# EAGLE design CaravanPi_V2 (EAGLE 9.6.2)
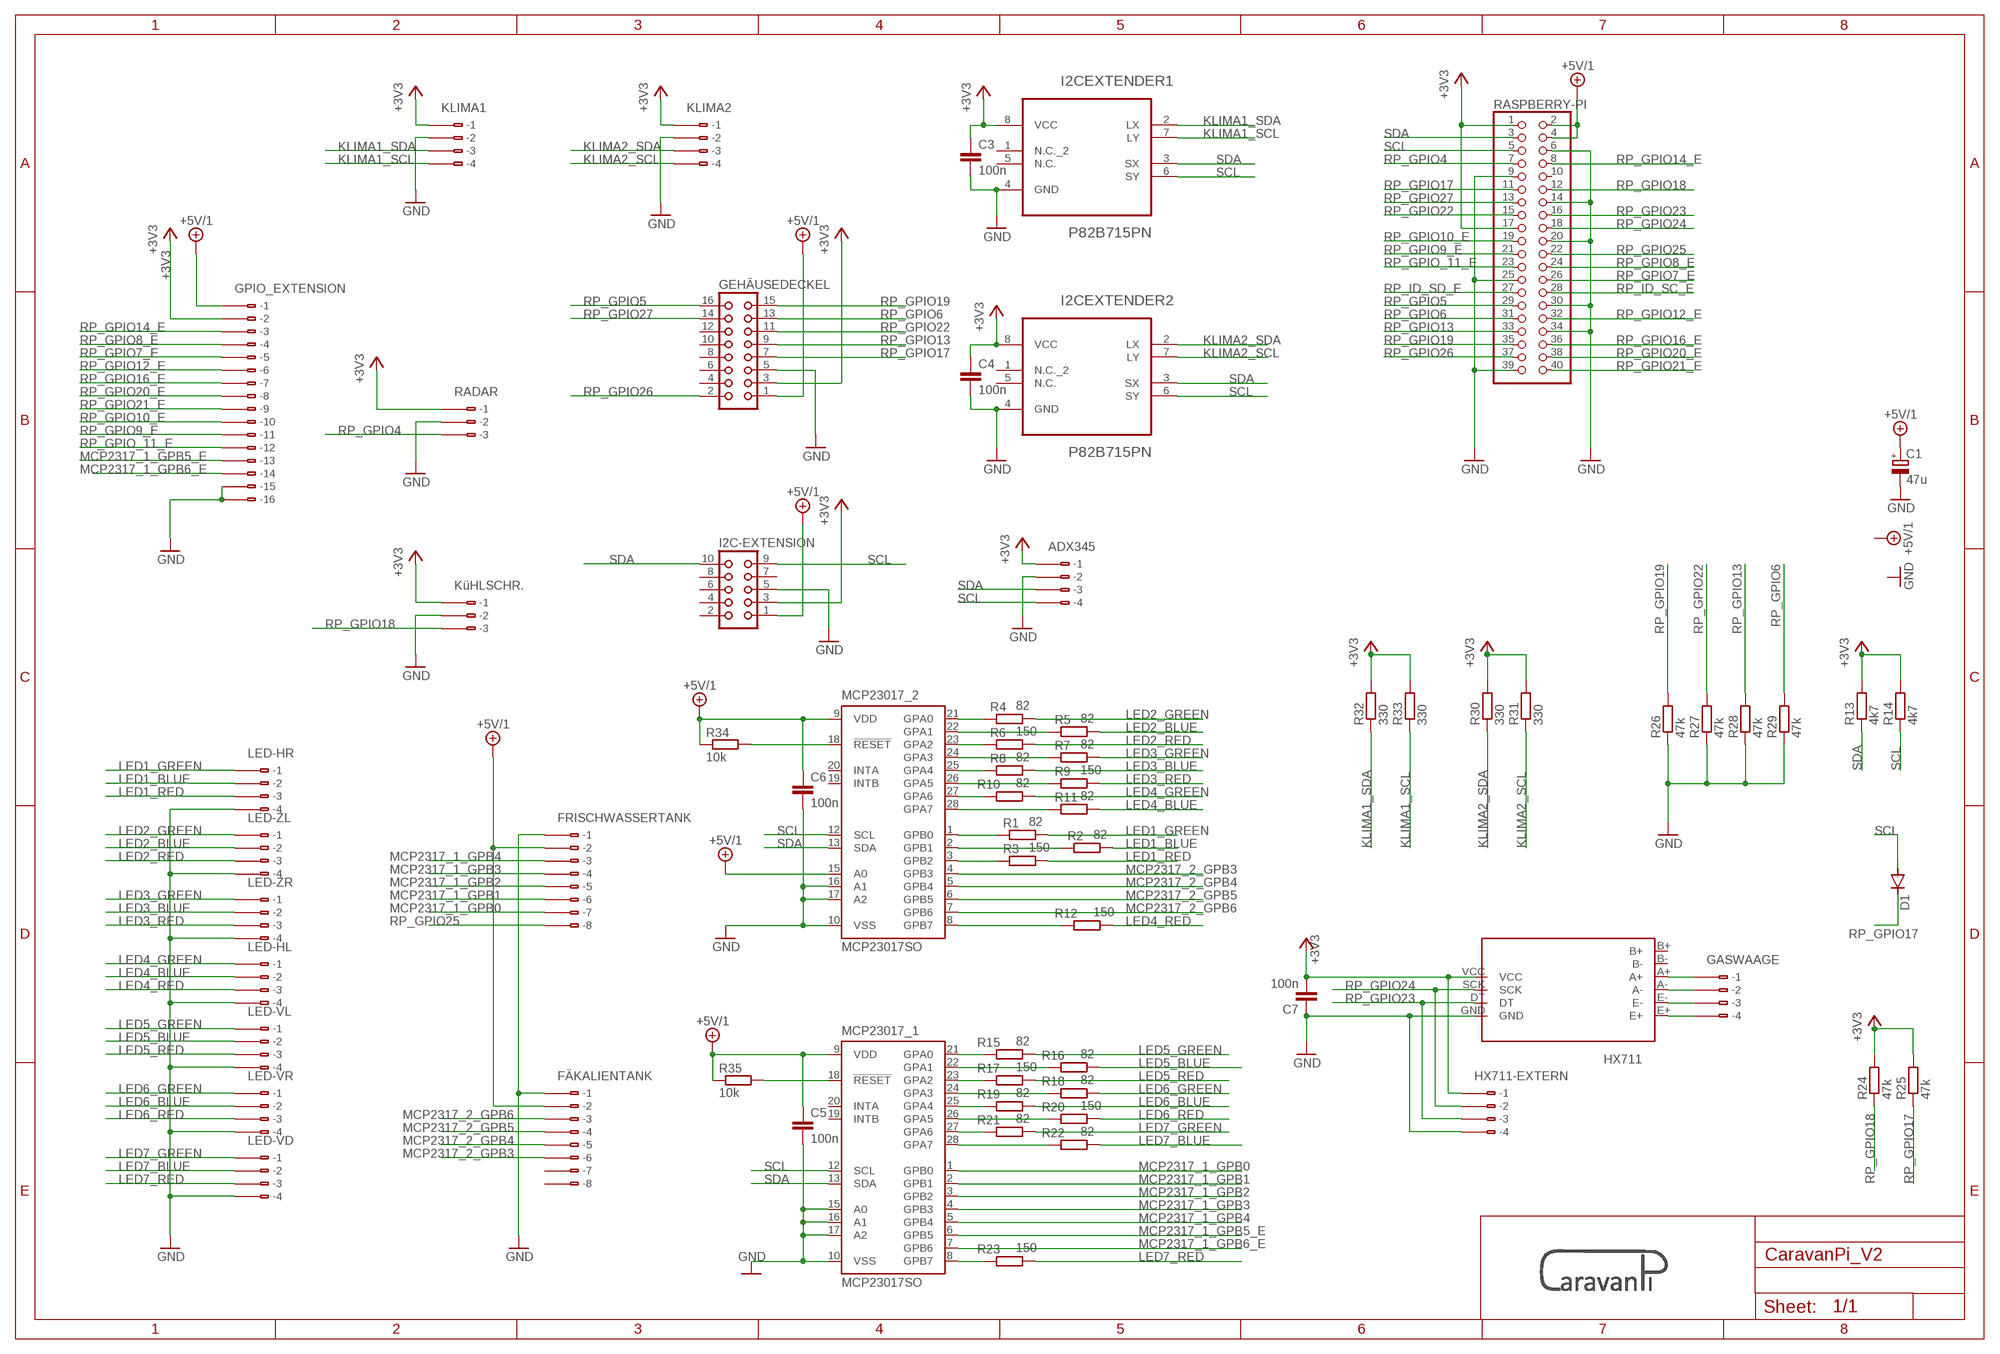
[diagram p0: schematic, sheet 1]

## Parts
ADX345  233-404  [233-404]
C1  47u  CPOL-EUSMCC  [SMC_C]
C3  100n  C-EUC1206  [C1206]
C4  100n  C-EUC1206  [C1206]
C5  100n  C-EUC1206  [C1206]
C6  100n  C-EUC1206  [C1206]
C7  100n  C-EUC1206  [C1206]
D1  DIODE-DO214AC  [DO214AC]
FRISCHWASSERTANK  233-408  [233-408]
FÄKALIENTANK  233-408  [233-408]
GASWAAGE  233-404  [233-404]
GEHÄUSEDECKEL  CON16  [CON16]
GPIO_EXTENSION  233-516  [233-516]
HX711  HX711A  [HX711]
HX711-EXTERN  233-404  [233-404]
I2C-EXTENSION  CON10  [CON10]
I2CEXTENDER1  P82B715PN  [DIP254P762X420-8]
I2CEXTENDER2  P82B715PN  [DIP254P762X420-8]
KLIMA1  233-404  [233-404]
KLIMA2  233-404  [233-404]
KüHLSCHR.  233-403  [233-403]
LED-HL  233-504  [233-504]
LED-HR  233-504  [233-504]
LED-VD  233-504  [233-504]
LED-VL  233-504  [233-504]
LED-VR  233-504  [233-504]
LED-ZL  233-504  [233-504]
LED-ZR  233-504  [233-504]
MCP23017_1  MCP23017SO  [SO28W]
MCP23017_2  MCP23017SO  [SO28W]
R1  82  R-EU_M1206  [M1206]
R2  82  R-EU_M1206  [M1206]
R3  150  R-EU_M1206  [M1206]
R4  82  R-EU_M1206  [M1206]
R5  82  R-EU_M1206  [M1206]
R6  150  R-EU_M1206  [M1206]
R7  82  R-EU_M1206  [M1206]
R8  82  R-EU_M1206  [M1206]
R9  150  R-EU_M1206  [M1206]
R10  82  R-EU_M1206  [M1206]
R11  82  R-EU_M1206  [M1206]
R12  150  R-EU_M1206  [M1206]
R13  4k7  R-EU_M1206  [M1206]
R14  4k7  R-EU_M1206  [M1206]
R15  82  R-EU_M1206  [M1206]
R16  82  R-EU_M1206  [M1206]
R17  150  R-EU_M1206  [M1206]
R18  82  R-EU_M1206  [M1206]
R19  82  R-EU_M1206  [M1206]
R20  150  R-EU_M1206  [M1206]
R21  82  R-EU_M1206  [M1206]
R22  82  R-EU_M1206  [M1206]
R23  150  R-EU_M1206  [M1206]
R24  47k  R-EU_M1206  [M1206]
R25  47k  R-EU_M1206  [M1206]
R26  47k  R-EU_M1206  [M1206]
R27  47k  R-EU_M1206  [M1206]
R28  47k  R-EU_M1206  [M1206]
R29  47k  R-EU_M1206  [M1206]
R30  330  R-EU_M1206  [M1206]
R31  330  R-EU_M1206  [M1206]
R32  330  R-EU_M1206  [M1206]
R33  330  R-EU_M1206  [M1206]
R34  10k  R-EU_M1206  [M1206]
R35  10k  R-EU_M1206  [M1206]
RADAR  233-403  [233-403]
RASPBERRY-PI  PINHD-2X20  [2X20]
U$1  CARAVAN_PI_LOGO  [CARAVAN_PI_LOGO]

## Nets
+3V3 [Power]: ADX345.B1(B-1) C3.1 C4.1 C7.2 GEHÄUSEDECKEL.3 GPIO_EXTENSION.B2(B-2) HX711-EXTERN.B1(B-1) HX711.VCC I2C-EXTENSION.3 I2CEXTENDER1.8(VCC) I2CEXTENDER2.8(VCC) KLIMA1.B1(B-1) KLIMA2.B1(B-1) KüHLSCHR..B1(B-1) R13.2 R14.2 R24.2 R25.2 R30.2 R31.2 R32.2 R33.2 RADAR.B1(B-1) RASPBERRY-PI.1 RASPBERRY-PI.17
+5V/1 [Power]: C1.+ C5.1 C6.1 FRISCHWASSERTANK.B2(B-2) FÄKALIENTANK.B2(B-2) GEHÄUSEDECKEL.1 GPIO_EXTENSION.B1(B-1) I2C-EXTENSION.1 MCP23017_1.9(VDD) MCP23017_2.9(VDD) MCP23017_2.15(A0) R34.1 R35.1 RASPBERRY-PI.2 RASPBERRY-PI.4
GND [Power]: ADX345.B2(B-2) C1.- C3.2 C4.2 C5.2 C6.2 C7.1 FRISCHWASSERTANK.B1(B-1) FÄKALIENTANK.B1(B-1) GEHÄUSEDECKEL.5 GPIO_EXTENSION.B15(B-15) GPIO_EXTENSION.B16(B-16) HX711-EXTERN.B4(B-4) HX711.GND I2C-EXTENSION.5 I2CEXTENDER1.4(GND) I2CEXTENDER2.4(GND) KLIMA1.B2(B-2) KLIMA2.B2(B-2) KüHLSCHR..B2(B-2) LED-HL.B4(B-4) LED-HR.B4(B-4) LED-VD.B4(B-4) LED-VL.B4(B-4) LED-VR.B4(B-4) LED-ZL.B4(B-4) LED-ZR.B4(B-4) MCP23017_1.10(VSS) MCP23017_1.15(A0) MCP23017_1.16(A1) MCP23017_1.17(A2) MCP23017_2.10(VSS) MCP23017_2.16(A1) MCP23017_2.17(A2) R26.1 R27.1 R28.1 R29.1 RADAR.B2(B-2) RASPBERRY-PI.6 RASPBERRY-PI.9 RASPBERRY-PI.14 RASPBERRY-PI.20 RASPBERRY-PI.25 RASPBERRY-PI.30 RASPBERRY-PI.34 RASPBERRY-PI.39
KLIMA1_SCL: I2CEXTENDER1.7(LY) KLIMA1.B4(B-4) R33.1
KLIMA1_SDA: I2CEXTENDER1.2(LX) KLIMA1.B3(B-3) R32.1
KLIMA2_SCL: I2CEXTENDER2.7(LY) KLIMA2.B4(B-4) R31.1
KLIMA2_SDA: I2CEXTENDER2.2(LX) KLIMA2.B3(B-3) R30.1
LED1_BLUE: LED-HR.B2(B-2) R2.2
LED1_GREEN: LED-HR.B1(B-1) R1.2
LED1_RED: LED-HR.B3(B-3) R3.2
LED2_BLUE: LED-ZL.B2(B-2) R5.2
LED2_GREEN: LED-ZL.B1(B-1) R4.2
LED2_RED: LED-ZL.B3(B-3) R6.2
LED3_BLUE: LED-ZR.B2(B-2) R8.2
LED3_GREEN: LED-ZR.B1(B-1) R7.2
LED3_RED: LED-ZR.B3(B-3) R9.2
LED4_BLUE: LED-HL.B2(B-2) R11.2
LED4_GREEN: LED-HL.B1(B-1) R10.2
LED4_RED: LED-HL.B3(B-3) R12.2
LED5_BLUE: LED-VL.B2(B-2) R16.2
LED5_GREEN: LED-VL.B1(B-1) R15.2
LED5_RED: LED-VL.B3(B-3) R17.2
LED6_BLUE: LED-VR.B2(B-2) R19.2
LED6_GREEN: LED-VR.B1(B-1) R18.2
LED6_RED: LED-VR.B3(B-3) R20.2
LED7_BLUE: LED-VD.B2(B-2) R22.2
LED7_GREEN: LED-VD.B1(B-1) R21.2
LED7_RED: LED-VD.B3(B-3) R23.2
MCP2317_1_GPB0: FRISCHWASSERTANK.B7(B-7) MCP23017_1.1(GPB0)
MCP2317_1_GPB1: FRISCHWASSERTANK.B6(B-6) MCP23017_1.2(GPB1)
MCP2317_1_GPB2: FRISCHWASSERTANK.B5(B-5) MCP23017_1.3(GPB2)
MCP2317_1_GPB3: FRISCHWASSERTANK.B4(B-4) MCP23017_1.4(GPB3)
MCP2317_1_GPB4: FRISCHWASSERTANK.B3(B-3) MCP23017_1.5(GPB4)
MCP2317_1_GPB5_E: GPIO_EXTENSION.B13(B-13) MCP23017_1.6(GPB5)
MCP2317_1_GPB6_E: GPIO_EXTENSION.B14(B-14) MCP23017_1.7(GPB6)
MCP2317_2_GPB3: FÄKALIENTANK.B6(B-6) MCP23017_2.4(GPB3)
MCP2317_2_GPB4: FÄKALIENTANK.B5(B-5) MCP23017_2.5(GPB4)
MCP2317_2_GPB5: FÄKALIENTANK.B4(B-4) MCP23017_2.6(GPB5)
MCP2317_2_GPB6: FÄKALIENTANK.B3(B-3) MCP23017_2.7(GPB6)
N$1: MCP23017_2.1(GPB0) R1.1
N$2: MCP23017_2.2(GPB1) R2.1
N$3: MCP23017_2.3(GPB2) R3.1
N$4: MCP23017_2.21(GPA0) R4.1
N$5: MCP23017_2.22(GPA1) R5.1
N$6: MCP23017_2.23(GPA2) R6.1
N$7: MCP23017_2.24(GPA3) R7.1
N$8: MCP23017_2.25(GPA4) R8.1
N$9: MCP23017_2.26(GPA5) R9.1
N$10: MCP23017_2.27(GPA6) R10.1
N$11: MCP23017_2.28(GPA7) R11.1
N$12: MCP23017_2.8(GPB7) R12.1
N$13: MCP23017_1.21(GPA0) R15.1
N$14: MCP23017_1.22(GPA1) R16.1
N$15: MCP23017_1.23(GPA2) R17.1
N$16: MCP23017_1.24(GPA3) R18.1
N$17: MCP23017_1.25(GPA4) R19.1
N$18: MCP23017_1.26(GPA5) R20.1
N$19: MCP23017_1.27(GPA6) R21.1
N$20: MCP23017_1.28(GPA7) R22.1
N$21: MCP23017_2.18(!RESET) R34.2
N$22: MCP23017_1.18(!RESET) R35.2
N$23: GASWAAGE.B4(B-4) HX711.E+
N$24: GASWAAGE.B3(B-3) HX711.E-
N$25: GASWAAGE.B2(B-2) HX711.A-
N$26: GASWAAGE.B1(B-1) HX711.A+
N$29: MCP23017_1.8(GPB7) R23.1
RP_GPIO4: RADAR.B3(B-3) RASPBERRY-PI.7
RP_GPIO5: GEHÄUSEDECKEL.16 RASPBERRY-PI.29
RP_GPIO6: GEHÄUSEDECKEL.13 R29.2 RASPBERRY-PI.31
RP_GPIO7_E: GPIO_EXTENSION.B5(B-5) RASPBERRY-PI.26
RP_GPIO8_E: GPIO_EXTENSION.B4(B-4) RASPBERRY-PI.24
RP_GPIO9_E: GPIO_EXTENSION.B11(B-11) RASPBERRY-PI.21
RP_GPIO10_E: GPIO_EXTENSION.B10(B-10) RASPBERRY-PI.19
RP_GPIO12_E: GPIO_EXTENSION.B6(B-6) RASPBERRY-PI.32
RP_GPIO13: GEHÄUSEDECKEL.9 R28.2 RASPBERRY-PI.33
RP_GPIO14_E: GPIO_EXTENSION.B3(B-3) RASPBERRY-PI.8
RP_GPIO16_E: GPIO_EXTENSION.B7(B-7) RASPBERRY-PI.36
RP_GPIO17: D1.C GEHÄUSEDECKEL.7 R25.1 RASPBERRY-PI.11
RP_GPIO18: KüHLSCHR..B3(B-3) R24.1 RASPBERRY-PI.12
RP_GPIO19: GEHÄUSEDECKEL.15 R26.2 RASPBERRY-PI.35
RP_GPIO20_E: GPIO_EXTENSION.B8(B-8) RASPBERRY-PI.38
RP_GPIO21_E: GPIO_EXTENSION.B9(B-9) RASPBERRY-PI.40
RP_GPIO22: GEHÄUSEDECKEL.11 R27.2 RASPBERRY-PI.15
RP_GPIO23: HX711-EXTERN.B3(B-3) HX711.DT RASPBERRY-PI.16
RP_GPIO24: HX711-EXTERN.B2(B-2) HX711.SCK RASPBERRY-PI.18
RP_GPIO25: FRISCHWASSERTANK.B8(B-8) RASPBERRY-PI.22
RP_GPIO26: GEHÄUSEDECKEL.2 RASPBERRY-PI.37
RP_GPIO27: GEHÄUSEDECKEL.14 RASPBERRY-PI.13
RP_GPIO_11_E: GPIO_EXTENSION.B12(B-12) RASPBERRY-PI.23
RP_ID_SC_E: RASPBERRY-PI.28
RP_ID_SD_E: RASPBERRY-PI.27
SCL: ADX345.B4(B-4) D1.A I2C-EXTENSION.9 I2CEXTENDER1.6(SY) I2CEXTENDER2.6(SY) MCP23017_1.12(SCL) MCP23017_2.12(SCL) R14.1 RASPBERRY-PI.5
SDA: ADX345.B3(B-3) I2C-EXTENSION.10 I2CEXTENDER1.3(SX) I2CEXTENDER2.3(SX) MCP23017_1.13(SDA) MCP23017_2.13(SDA) R13.1 RASPBERRY-PI.3
Unconnected: ADX345.A1(-1) ADX345.A2(-2) ADX345.A3(-3) ADX345.A4(-4) FRISCHWASSERTANK.A1(-1) FRISCHWASSERTANK.A2(-2) FRISCHWASSERTANK.A3(-3) FRISCHWASSERTANK.A4(-4) FRISCHWASSERTANK.A5(-5) FRISCHWASSERTANK.A6(-6) FRISCHWASSERTANK.A7(-7) FRISCHWASSERTANK.A8(-8) FÄKALIENTANK.A1(-1) FÄKALIENTANK.A2(-2) FÄKALIENTANK.A3(-3) FÄKALIENTANK.A4(-4) FÄKALIENTANK.A5(-5) FÄKALIENTANK.A6(-6) FÄKALIENTANK.A7(-7) FÄKALIENTANK.A8(-8) FÄKALIENTANK.B7(B-7) FÄKALIENTANK.B8(B-8) GASWAAGE.A1(-1) GASWAAGE.A2(-2) GASWAAGE.A3(-3) GASWAAGE.A4(-4) GEHÄUSEDECKEL.4 GEHÄUSEDECKEL.6 GEHÄUSEDECKEL.8 GEHÄUSEDECKEL.10 GEHÄUSEDECKEL.12 GPIO_EXTENSION.A1(-1) GPIO_EXTENSION.A2(-2) GPIO_EXTENSION.A3(-3) GPIO_EXTENSION.A4(-4) GPIO_EXTENSION.A5(-5) GPIO_EXTENSION.A6(-6) GPIO_EXTENSION.A7(-7) GPIO_EXTENSION.A8(-8) GPIO_EXTENSION.A9(-9) GPIO_EXTENSION.A10(-10) GPIO_EXTENSION.A11(-11) GPIO_EXTENSION.A12(-12) GPIO_EXTENSION.A13(-13) GPIO_EXTENSION.A14(-14) GPIO_EXTENSION.A15(-15) GPIO_EXTENSION.A16(-16) HX711-EXTERN.A1(-1) HX711-EXTERN.A2(-2) HX711-EXTERN.A3(-3) HX711-EXTERN.A4(-4) HX711.B+ HX711.B- I2C-EXTENSION.2 I2C-EXTENSION.4 I2C-EXTENSION.6 I2C-EXTENSION.7 I2C-EXTENSION.8 I2CEXTENDER1.1(N.C._2) I2CEXTENDER1.5(N.C.) I2CEXTENDER2.1(N.C._2) I2CEXTENDER2.5(N.C.) KLIMA1.A1(-1) KLIMA1.A2(-2) KLIMA1.A3(-3) KLIMA1.A4(-4) KLIMA2.A1(-1) KLIMA2.A2(-2) KLIMA2.A3(-3) KLIMA2.A4(-4) KüHLSCHR..A1(-1) KüHLSCHR..A2(-2) KüHLSCHR..A3(-3) LED-HL.A1(-1) LED-HL.A2(-2) LED-HL.A3(-3) LED-HL.A4(-4) LED-HR.A1(-1) LED-HR.A2(-2) LED-HR.A3(-3) LED-HR.A4(-4) LED-VD.A1(-1) LED-VD.A2(-2) LED-VD.A3(-3) LED-VD.A4(-4) LED-VL.A1(-1) LED-VL.A2(-2) LED-VL.A3(-3) LED-VL.A4(-4) LED-VR.A1(-1) LED-VR.A2(-2) LED-VR.A3(-3) LED-VR.A4(-4) LED-ZL.A1(-1) LED-ZL.A2(-2) LED-ZL.A3(-3) LED-ZL.A4(-4) LED-ZR.A1(-1) LED-ZR.A2(-2) LED-ZR.A3(-3) LED-ZR.A4(-4) MCP23017_1.19(INTB) MCP23017_1.20(INTA) MCP23017_2.19(INTB) MCP23017_2.20(INTA) RADAR.A1(-1) RADAR.A2(-2) RADAR.A3(-3) RASPBERRY-PI.10

## Library data of the parts
ADX345 GASWAAGE HX711-EXTERN KLIMA1 KLIMA2 = con-wago:233-404: WAGO Cage Clamp; MPN: 233-404; OC_FARNELL: 1601355; OC_NEWARK: 28K9077
C1 = rcl:CPOL-EU: POLARIZED CAPACITOR, European symbol
C3-C7 = rcl:C-EU: CAPACITOR, European symbol; SPICEPREFIX: C
D1 = diode:DIODE-: DIODE
FRISCHWASSERTANK FÄKALIENTANK = con-wago:233-408: WAGO Cage Clamp; MPN: 233-408; OC_FARNELL: 1601358; OC_NEWARK: 28K9080
GEHÄUSEDECKEL = con-harting:CON16: CONNECTOR; OC_FARNELL: unknown; OC_NEWARK: unknown
GPIO_EXTENSION = con-wago:233-516: WAGO Cage Clamp; MF: Wago Corporation; MPN: 0233-0516; OC_FARNELL: 1777103; OC_NEWARK: 79K2056
HX711 = HX711:HX711
I2C-EXTENSION = con-harting:CON10: CONNECTOR; OC_FARNELL: unknown; OC_NEWARK: unknown
I2CEXTENDER1 I2CEXTENDER2 = NXP_By_element14_Batch_1:P82B715PN: I2C-bus extender; MPN: P82B715PN; OC_FARNELL: 1211741; OC_NEWARK: 24M6586; PACKAGE: DIP-8; SUPPLIER: NXP
KüHLSCHR. RADAR = con-wago:233-403: WAGO Cage Clamp; MPN: 233-403; OC_FARNELL: 1601354; OC_NEWARK: 28K9076
LED-HL LED-HR LED-VD LED-VL LED-VR LED-ZL LED-ZR = con-wago:233-504: WAGO Cage Clamp; MF: Wago Corporation; MPN: 0233-0504; OC_FARNELL: 1777098; OC_NEWARK: 79K2050
MCP23017_1 MCP23017_2 = adafruit:MCP23017: http://ww1.microchip.com/downloads/en/DeviceDoc/21952a.pdf Source: http://ww1.microchip.com/downloads/en/DeviceDoc/21952a.pdf
R1-R35 = rcl:R-EU_: RESISTOR, European symbol; SPICEPREFIX: R
RASPBERRY-PI = pinhead:PINHD-2X20: PIN HEADER
U$1 = caravanPI_logo:CARAVAN_PI_LOGO: Caravan_PI_logo

## Net classes
0 default: width 0.508 mm, drill 0.305 mm
1 Power: width 1.016 mm

## Board
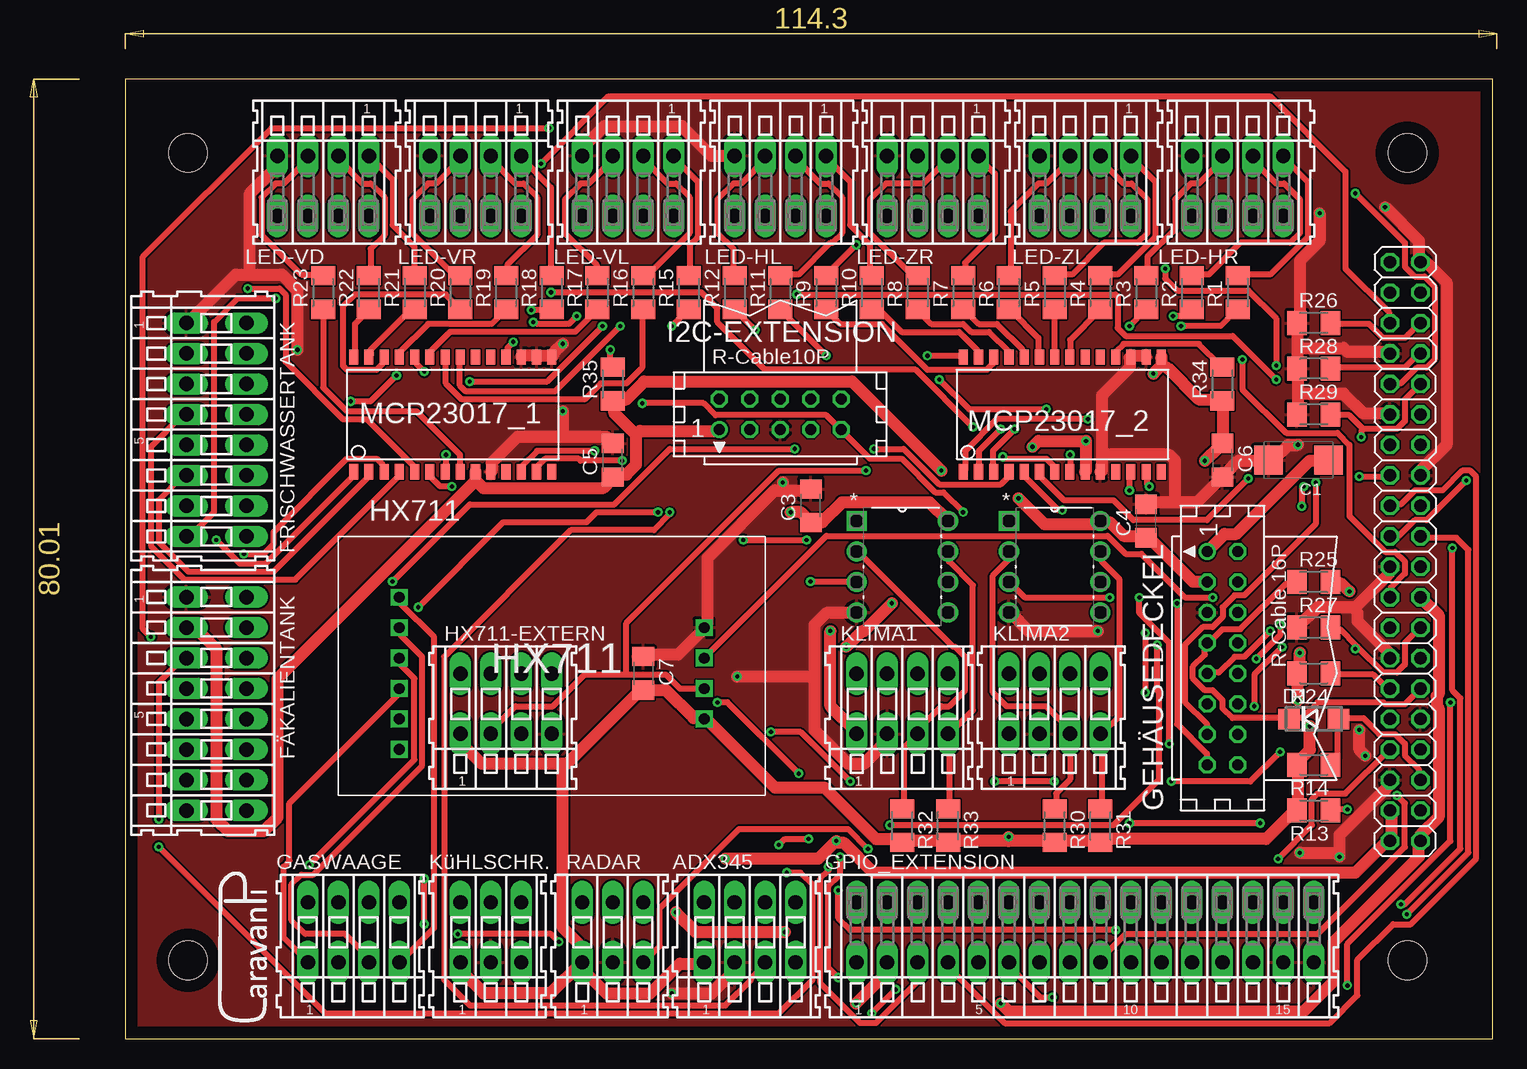
[diagram p1: board, top side]
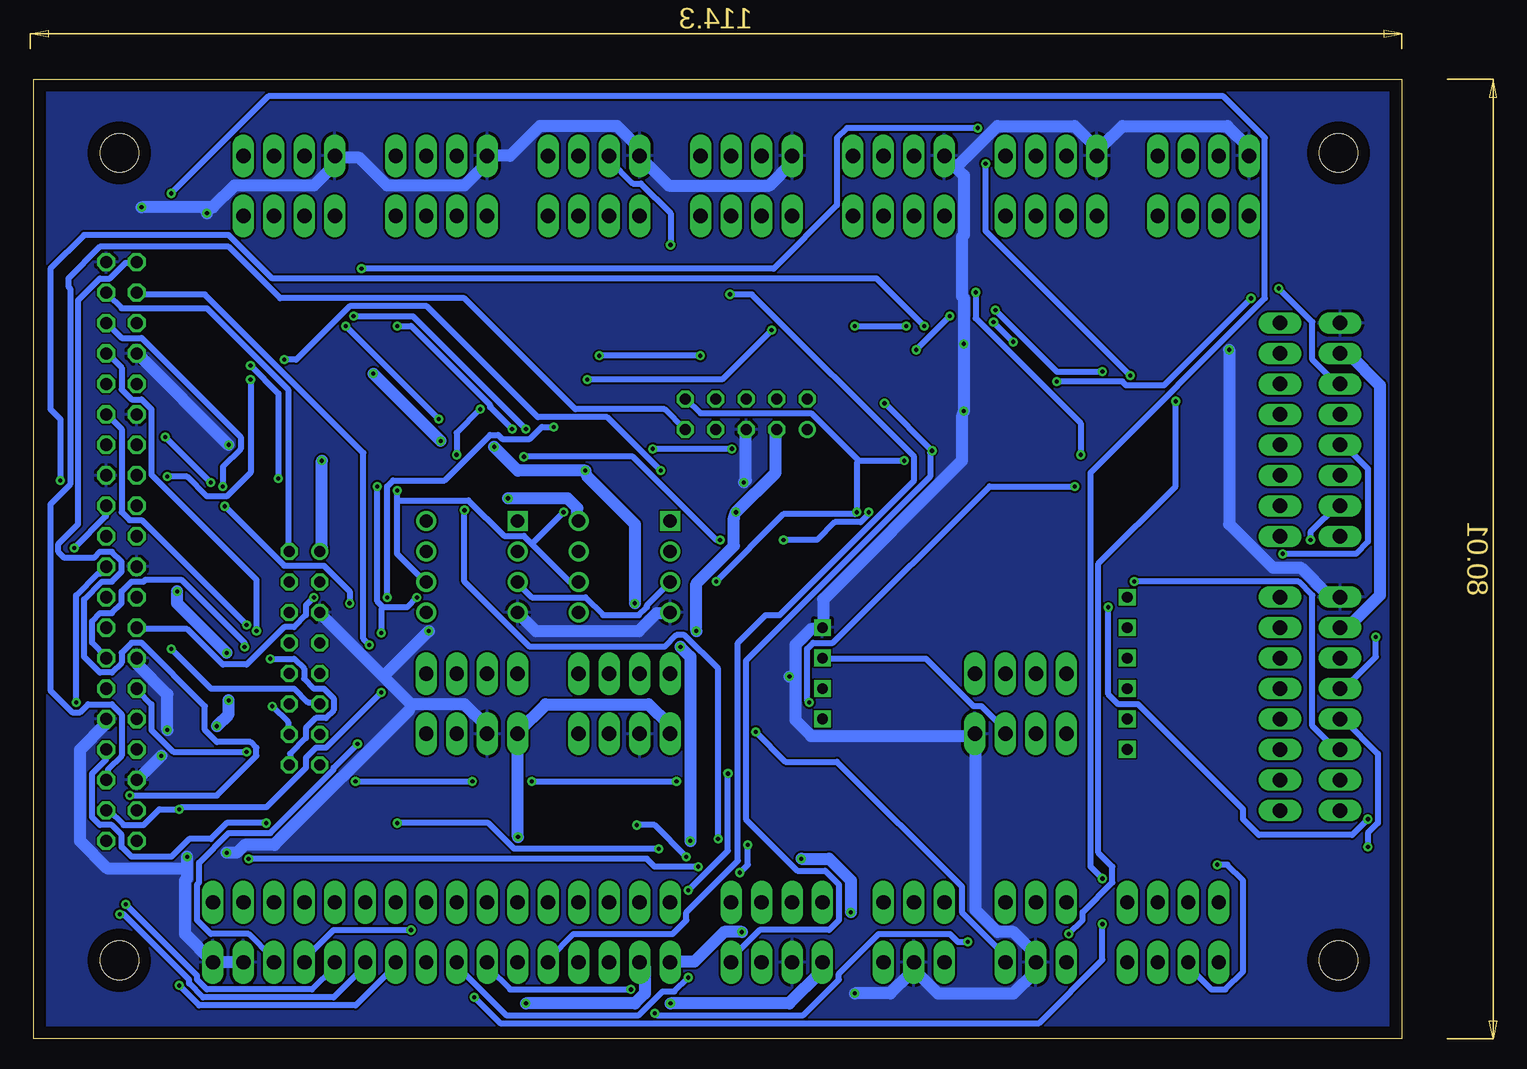
[diagram p2: board, bottom side, seen from below]

Size 113.97 x 80 mm. Coordinates in mm from the lower left corner, seen from the top.
Outline: 0,0 113.97,0 113.97,80 0,80 0,0
Copper layers (1*16): Top 0.035mm / dielectric 1.5mm / Bottom 0.035mm
Design rules "default": minimum track width 6mil, minimum drill 0.35mm, track to track 6mil, track to pad 6mil, pad to pad 6mil, via to via 6mil, smd to smd 6mil, copper to edge 40mil, drill to drill 6mil, minimum pad ring 10mil, minimum via ring 8mil, stop-mask expansion 4mil, vias tented up to drill 0mil, thermal gap 10mil
Holes 3.2 mm at 5.25,73.86 106.86,73.86 106.86,6.55 5.25,6.55

### Footprints (pad centres in the part's own frame; a part is rotated, then mirrored left to right if it is on the bottom)
233-404 = drill 1.2 long: A1 -3.81,2.5; A2 -1.27,2.5; A3 1.27,2.5; A4 3.81,2.5; B1 -3.81,-2.5; B2 -1.27,-2.5; B3 1.27,-2.5; B4 3.81,-2.5
SMC_C = smd 2.4 x 2.4: + -2.5,0; - 2.5,0
C1206 = smd 1.6 x 1.8: 1 -1.4,0; 2 1.4,0
DO214AC = smd 1.8 x 1.7: A 2.05,0; C -2.05,0
233-408 = drill 1.2 long: A1 -8.89,2.5; A2 -6.35,2.5; A3 -3.81,2.5; A4 -1.27,2.5; A5 1.27,2.5; A6 3.81,2.5; A7 6.35,2.5; A8 8.89,2.5; B1 -8.89,-2.5; B2 -6.35,-2.5; B3 -3.81,-2.5; B4 -1.27,-2.5; B5 1.27,-2.5; B6 3.81,-2.5; B7 6.35,-2.5; B8 8.89,-2.5
CON16 = drill 0.914: 1 -8.89,-1.27 | drill 0.914 octagon: 2 -8.89,1.27; 3 -6.35,-1.27; 4 -6.35,1.27; 5 -3.81,-1.27; 6 -3.81,1.27; 7 -1.27,-1.27; 8 -1.27,1.27; 9 1.27,-1.27; 10 1.27,1.27; 11 3.81,-1.27; 12 3.81,1.27; 13 6.35,-1.27; 14 6.35,1.27; 15 8.89,-1.27; 16 8.89,1.27
233-516 = drill 1.2 long: A1 -19.05,2.5; A2 -16.51,2.5; A3 -13.97,2.5; A4 -11.43,2.5; A5 -8.89,2.5; A6 -6.35,2.5; A7 -3.81,2.5; A8 -1.27,2.5; A9 1.27,2.5; A10 3.81,2.5; A11 6.35,2.5; A12 8.89,2.5; A13 11.43,2.5; A14 13.97,2.5; A15 16.51,2.5; A16 19.05,2.5; B1 -19.05,-2.5; B2 -16.51,-2.5; B3 -13.97,-2.5; B4 -11.43,-2.5; B5 -8.89,-2.5; B6 -6.35,-2.5; B7 -3.81,-2.5; B8 -1.27,-2.5; B9 1.27,-2.5; B10 3.81,-2.5; B11 6.35,-2.5; B12 8.89,-2.5; B13 11.43,-2.5; B14 13.97,-2.5; B15 16.51,-2.5; B16 19.05,-2.5
HX711 = drill 0.9 square: A+ 5.08,8.89; A- 5.08,11.43; B+ 5.08,3.81; B- 5.08,6.35; DT 30.48,11.43; E+ 5.08,16.51; E- 5.08,13.97; GND 30.48,13.97; SCK 30.48,8.89; VCC 30.48,6.35
CON10 = drill 0.914: 1 -5.08,-1.27 | drill 0.914 octagon: 2 -5.08,1.27; 3 -2.54,-1.27; 4 -2.54,1.27; 5 0,-1.27; 6 0,1.27; 7 2.54,-1.27; 8 2.54,1.27; 9 5.08,-1.27; 10 5.08,1.27
DIP254P762X420-8 = drill 1.118 square: 1 -7.62,7.62 | drill 1.118: 2 -7.62,5.08; 3 -7.62,2.54; 4 -7.62,0; 5 0,0; 6 0,2.54; 7 0,5.08; 8 0,7.62
233-403 = drill 1.2 long: A1 -2.54,2.5; A2 0,2.5; A3 2.54,2.5; B1 -2.54,-2.5; B2 0,-2.5; B3 2.54,-2.5
233-504 = drill 1.2 long: A1 -3.81,2.5; A2 -1.27,2.5; A3 1.27,2.5; A4 3.81,2.5; B1 -3.81,-2.5; B2 -1.27,-2.5; B3 1.27,-2.5; B4 3.81,-2.5
SO28W = smd 0.762 x 1.27: 1 -7.62,-4.78; 2 -6.35,-4.78; 3 -5.08,-4.78; 4 -3.81,-4.78; 5 -2.54,-4.78; 6 -1.27,-4.78; 7 0,-4.78; 8 1.27,-4.78; 9 2.54,-4.78; 10 3.81,-4.78; 11 5.08,-4.78; 12 6.35,-4.78; 13 7.62,-4.78; 14 8.89,-4.78; 15 8.89,4.78; 16 7.62,4.78; 17 6.35,4.78; 18 5.08,4.78; 19 3.81,4.78; 20 2.54,4.78; 21 1.27,4.78; 22 0,4.78; 23 -1.27,4.78; 24 -2.54,4.78; 25 -3.81,4.78; 26 -5.08,4.78; 27 -6.35,4.78; 28 -7.62,4.78
M1206 = smd 1.6 x 2: 1 -1.4,0; 2 1.4,0
2X20 = drill 1.016 octagon: 1 -24.13,-1.27; 2 -24.13,1.27; 3 -21.59,-1.27; 4 -21.59,1.27; 5 -19.05,-1.27; 6 -19.05,1.27; 7 -16.51,-1.27; 8 -16.51,1.27; 9 -13.97,-1.27; 10 -13.97,1.27; 11 -11.43,-1.27; 12 -11.43,1.27; 13 -8.89,-1.27; 14 -8.89,1.27; 15 -6.35,-1.27; 16 -6.35,1.27; 17 -3.81,-1.27; 18 -3.81,1.27; 19 -1.27,-1.27; 20 -1.27,1.27; 21 1.27,-1.27; 22 1.27,1.27; 23 3.81,-1.27; 24 3.81,1.27; 25 6.35,-1.27; 26 6.35,1.27; 27 8.89,-1.27; 28 8.89,1.27; 29 11.43,-1.27; 30 11.43,1.27; 31 13.97,-1.27; 32 13.97,1.27; 33 16.51,-1.27; 34 16.51,1.27; 35 19.05,-1.27; 36 19.05,1.27; 37 21.59,-1.27; 38 21.59,1.27; 39 24.13,-1.27; 40 24.13,1.27

### Placement (x,y rotation side)
ADX345  52.07,8.89 0 top
C1  97.79,48.26 180 top
C3  57.15,44.45 90 top
C4  85.09,43.18 90 top
C5  40.64,48.26 90 top
C6  91.44,48.26 270 top
C7  43.18,30.48 270 top
D1  99.06,26.67 0 top
FRISCHWASSERTANK  7.62,50.8 270 top
FÄKALIENTANK  7.62,27.94 270 top
GASWAAGE  19.05,8.89 0 top
GEHÄUSEDECKEL  91.44,31.75 270 top
GPIO_EXTENSION  80.01,8.89 0 top
HX711  17.78,20.32 0 top
HX711-EXTERN  31.75,27.94 0 top
I2C-EXTENSION  54.61,52.07 0 top
I2CEXTENDER1  68.58,35.56 0 top
I2CEXTENDER2  81.28,35.56 0 top
KLIMA1  64.77,27.94 0 top
KLIMA2  77.47,27.94 0 top
KüHLSCHR.  30.48,8.89 0 top
LED-HL  54.61,71.12 180 top
LED-HR  92.71,71.12 180 top
LED-VD  16.51,71.12 180 top
LED-VL  41.91,71.12 180 top
LED-VR  29.21,71.12 180 top
LED-ZL  80.01,71.12 180 top
LED-ZR  67.31,71.12 180 top
MCP23017_1  26.67,52.07 0 top
MCP23017_2  77.47,52.07 0 top
R1  92.71,62.23 90 top
R2  88.9,62.23 90 top
R3  85.09,62.23 90 top
R4  81.28,62.23 90 top
R5  77.47,62.23 90 top
R6  73.66,62.23 90 top
R7  69.85,62.23 90 top
R8  66.04,62.23 90 top
R9  58.42,62.23 90 top
R10  62.23,62.23 90 top
R11  54.61,62.23 90 top
R12  50.8,62.23 90 top
R13  99.06,19.05 180 top
R14  99.06,22.86 180 top
R15  46.99,62.23 90 top
R16  43.18,62.23 90 top
R17  39.37,62.23 90 top
R18  35.56,62.23 90 top
R19  31.75,62.23 90 top
R20  27.94,62.23 90 top
R21  24.13,62.23 90 top
R22  20.32,62.23 90 top
R23  16.51,62.23 90 top
R24  99.06,30.48 180 top
R25  99.06,38.1 0 top
R26  99.06,59.69 0 top
R27  99.06,34.29 0 top
R28  99.06,55.88 0 top
R29  99.06,52.07 0 top
R30  77.47,17.78 270 top
R31  81.28,17.78 270 top
R32  64.77,17.78 270 top
R33  68.58,17.78 270 top
R34  91.44,54.61 90 top
R35  40.64,54.61 90 top
RADAR  40.64,8.89 0 top
RASPBERRY-PI  106.68,40.64 90 top
U$1  12.7,1.27 90 top

### Tracks (layer width: path | path; a pad name or v marks a point on that pad's centre or on a via)
+3V3  (via drill 0.35)
  Top 1.016: GEHÄUSEDECKEL.3 90.14,38.14 88.99,38.14 85.52,41.6 C4.1 85.03,41.94 83.21,41.94 82.06,43.09 81.39,43.09 I2CEXTENDER2.8 80.9,42.93 76.61,42.93 v74.46,45.07 | I2CEXTENDER1.8 68.52,43.26 67.03,44.74 59.77,44.74 58.12,43.09 57.29,43.09 C3.1 56.79,43.42 56.3,43.92 v55.47,43.92 | 73.64,16.51 77.1,16.51 R30.2 77.6,16.51 81.23,16.51 R31.2 81.72,16.68 95.1,16.68 97.24,18.82 R13.2 97.74,19.15 97.74,22.78 R14.2 97.9,23.28 98.73,24.11 v98.73,26.09 | 73.64,16.51 69.01,16.51 R33.2 68.52,16.51 64.88,16.51 R32.2 64.39,16.68 62.57,16.68 58.28,20.97 54.15,20.97 48.7,26.42 HX711.VCC 48.21,26.75 47.38,26.75 45.07,29.06 43.26,29.06 C7.2 42.76,28.89 36.82,22.95 36.49,22.95 | v97.74,28.23 97.74,30.38 R24.2 97.9,30.87 v97.9,32.19 | v102.03,37.31 101.37,37.97 100.55,37.97 R25.2 | v73.64,16.84 73.64,16.51 | v58.78,34.01 58.78,27.74 60.92,25.59 KLIMA1.B1 | 36.49,22.95 29.72,22.95 28.07,24.6 28.07,25.43 HX711-EXTERN.B1 | RASPBERRY-PI.17 107.97,36.82 109.46,35.33 109.46,28.73 109.3,28.56 109.3,27.74 109.46,27.57 109.46,18.49 107.97,17 107.97,16.51 RASPBERRY-PI.1 107.81,16.02 107.81,15.19 100.71,8.09 100.71,4.79 98.23,2.31 73.64,2.31 v72.97,2.97 | KüHLSCHR..B1 28.07,6.27 28.07,5.61 29.88,3.8 35.5,3.8 37.97,6.27 RADAR.B1 | ADX345.B1 48.21,6.27 46.23,6.27 43.75,3.8 40.12,3.8 38.14,5.78 RADAR.B1 | v60.92,2.97 63.4,5.45 63.4,6.27 GPIO_EXTENSION.B2 | 36.49,22.95 36.49,9.25 37.81,7.92 37.81,6.77 RADAR.B1
  Bottom 1.016: I2C-EXTENSION.3 52.17,50.69 52.17,47.22 v55.47,43.92 55.64,43.42 55.64,41.11 58.78,37.97 v58.78,34.01 | v74.46,45.07 69.51,45.07 68.68,44.25 68.68,43.26 I2CEXTENDER1.8 | KLIMA1.B1 61.09,25.59 61.09,26.25 62.74,27.9 71.32,27.9 73.64,25.59 KLIMA2.B1 73.64,24.93 v73.64,16.84 | v97.74,28.23 97.74,27.08 v98.73,26.09 | v102.03,37.31 102.03,36.32 v97.9,32.19 | v60.92,2.97 51.02,2.97 48.37,5.61 48.37,6.27 ADX345.B1 | v72.97,2.97 63.89,2.97 63.07,3.8 63.07,5.94 63.4,6.27 GPIO_EXTENSION.B2
+5V/1  (via drill 0.35)
  Top 1.016: RASPBERRY-PI.4 105.5,18.99 105.5,16.51 RASPBERRY-PI.2 105,16.34 102.53,13.87 62.41,13.87 59.93,16.34 59.11,16.34 | v54.98,8.91 47.55,8.91 v45.9,10.57 | v50.02,15.02 57.78,15.02 59.11,16.34 | 86.35,56.13 v85.69,55.47 | 86.35,56.13 86.35,56.79 MCP23017_2.15 | MCP23017_2.9 80.07,47.38 v80.07,49.86 76.11,49.86 v75.62,49.37 | 86.35,56.13 86.84,55.97 89.48,53.33 90.97,53.33 R34.1 91.47,53.16 91.47,49.7 C6.1 91.14,49.37 v89.98,48.21 | GEHÄUSEDECKEL.1 91.63,42.1 92.62,42.1 98.73,48.21 100.22,48.21 C1.+ | 29.22,46.56 29.22,47.22 MCP23017_1.9 | 29.22,46.56 29.88,45.9 39.79,45.9 40.62,46.72 C5.1 41.11,47.05 41.77,47.05 42.6,47.88 42.6,50.35 | 42.6,50.35 40.78,52.17 40.78,53.16 R35.1 41.27,53.33 41.77,53.33 43.26,54.81 60.59,54.81 v68.02,47.38 | I2C-EXTENSION.1 49.53,50.69 42.93,50.69 42.6,50.35 | 29.22,46.56 12.71,30.05 12.71,18.49 11.56,17.34 8.59,17.34 7.59,18.33 7.59,32.52 5.94,34.18 5.28,34.18 FÄKALIENTANK.B2 | v60.1,32.69 61.42,34.01 61.58,34.01 v63.89,36.32 | v59.27,16.51 59.11,16.34
  Bottom 1.016: v54.98,8.91 56.46,8.91 58.94,6.44 60.92,6.44 GPIO_EXTENSION.B1 | v45.9,10.57 45.9,13.21 47.71,15.02 v50.02,15.02 | v85.69,55.47 v80.07,49.86 | v89.98,48.21 89.98,40.95 90.14,40.78 GEHÄUSEDECKEL.1 | FÄKALIENTANK.B2 5.12,34.34 4.46,34.34 1.82,36.98 1.82,54.48 4.46,57.12 5.12,57.12 FRISCHWASSERTANK.B2 | v75.62,49.37 73.64,47.38 v68.02,47.38 67.86,46.89 63.89,42.93 v63.89,36.32 | v59.27,16.51 59.27,31.86 v60.1,32.69
GND  (via drill 0.35)
  Top 1.016: 97.74,53.82 97.74,55.8 R28.1 97.74,56.3 97.74,57.62 | 97.74,53.82 97.74,52.17 R29.1 | 97.74,57.62 97.74,59.6 R26.1 97.9,60.1 97.9,64.88 99.56,66.53 v99.56,68.85 | 97.74,53.82 101.54,53.82 103.19,52.17 105.33,52.17 RASPBERRY-PI.30 | 97.74,57.62 101.54,57.62 101.87,57.29 105.33,57.29 RASPBERRY-PI.34 | 81.39,48.7 81.39,53.66 83.71,55.97 83.71,56.79 | 81.39,48.7 81.39,47.38 MCP23017_2.10 | 83.71,56.79 MCP23017_2.17 | MCP23017_2.16 85.03,56.96 84.2,56.96 83.71,56.79 | 87.5,44.74 89.32,44.74 91.3,46.72 C6.2 91.8,47.22 92.79,48.21 95.26,48.21 C1.- 95.76,48.37 96.91,49.53 v97.74,49.53 | 87.5,44.74 85.19,44.74 C4.2 | 81.39,48.7 87.01,48.7 87.5,48.21 87.5,44.74 | RASPBERRY-PI.25 107.97,47.05 107.97,47.38 110.12,49.53 110.12,63.07 108.47,64.72 107.97,64.72 RASPBERRY-PI.39 107.81,65.22 107.81,66.53 v105,69.34 | v14.36,57.45 14.36,62.41 13.04,63.73 10.4,63.73 | 10.4,63.73 9.25,63.73 5.28,59.77 FRISCHWASSERTANK.B1 | 10.4,63.73 10.4,70.5 12.55,72.64 12.55,73.47 LED-VD.B4 | 102.53,35.99 99.39,35.99 97.74,34.34 R27.1 | 102.53,35.99 105.33,38.8 105.33,39.29 RASPBERRY-PI.20 | RASPBERRY-PI.14 105.33,31.86 105.33,32.19 102.69,34.84 102.69,35.5 102.53,35.99 | v101.21,15.19 101.21,15.52 | 101.21,15.52 101.21,17 105.33,21.13 105.33,21.46 RASPBERRY-PI.6 | v102.86,25.76 102.86,24.11 v103.35,23.61 | 57.45,30.21 57.45,34.51 58.45,35.5 60.92,35.5 I2CEXTENDER1.4 | 57.45,30.21 57.45,25.76 60.26,22.95 61.58,22.95 63.4,24.77 63.4,25.43 KLIMA1.B2 | v81.06,34.01 75.29,34.01 73.8,35.5 I2CEXTENDER2.4 | v45.57,3.8 48.87,3.8 50.69,5.61 50.69,6.27 ADX345.B2 | C7.1 43.26,32.03 46.06,32.03 48.21,34.18 HX711.GND 48.54,34.67 48.54,40.12 54.15,45.73 54.81,45.73
  Top 1.016: 54.81,45.73 57.12,45.73 C3.2 | v54.81,46.39 54.81,45.73 | 36.49,50.19 40.12,50.19 40.62,49.7 C5.2 | 36.49,50.19 32.69,50.19 30.54,48.04 30.54,47.38 MCP23017_1.10 | 34.18,56.96 33.02,56.96 MCP23017_1.17 | 34.18,56.96 MCP23017_1.16 | 34.18,56.96 35.5,56.96 MCP23017_1.15 35.83,57.29 v36.49,57.95 | v36.49,52.34 36.49,50.19 | v51.02,30.21 57.45,30.21 | v97.9,15.52 101.21,15.52 | LED-HL.B4 50.69,73.64 48.87,73.64 46.39,76.11 39.95,76.11 38.14,74.3 38.14,73.64 LED-VL.B4
  Bottom 1.016: v97.74,49.53 105.33,57.12 RASPBERRY-PI.34 | LED-HL.B4 50.85,73.47 50.85,72.97 52.67,71.16 61.09,71.16 63.4,73.47 LED-ZR.B4 63.56,74.13 63.56,74.3 65.38,76.11 71.82,76.11 74.3,73.64 76.11,73.64 LED-ZL.B4 76.11,73.14 78.09,71.16 84.53,71.16 86.84,73.47 88.82,73.47 LED-HR.B4 88.82,72.97 90.64,71.16 97.24,71.16 99.06,69.34 99.56,69.34 | 99.56,69.34 v105,69.34 | v99.56,68.85 99.56,69.34 | v14.36,57.45 14.36,42.93 10.73,39.29 8.42,39.29 6.11,36.98 5.28,36.98 FÄKALIENTANK.B1 | 101.21,14.2 101.21,13.37 101.37,13.21 101.37,8.75 99.06,6.44 GPIO_EXTENSION.B16 98.56,6.44 96.58,6.44 GPIO_EXTENSION.B15 | 101.21,14.2 v101.21,15.19 | 101.21,14.2 107.81,14.2 110.12,16.51 110.12,24.11 107.97,26.25 107.97,26.58 RASPBERRY-PI.9 | v102.86,25.76 102.86,28.73 105.33,31.2 105.33,31.7 RASPBERRY-PI.14 | v103.35,23.61 105.33,21.63 RASPBERRY-PI.6 | 82.55,27.9 84.86,30.21 | 84.86,30.21 90.14,35.5 GEHÄUSEDECKEL.5 | 82.55,27.9 78.09,27.9 76.28,26.09 76.28,25.59 KLIMA2.B2 | I2CEXTENDER1.4 61.09,35.5 62.08,35.5 63.56,34.01 72.15,34.01 73.64,35.5 I2CEXTENDER2.4 | v81.06,34.01 84.86,30.21 | v45.57,3.8 42.6,3.8 40.95,5.45 RADAR.B2 40.62,6.27 40.62,5.78 38.63,3.8 32.36,3.8 30.54,5.61 30.54,6.27 KüHLSCHR..B2 30.71,6.77 30.71,7.26 32.36,8.91 33.68,8.91 35.5,10.73 35.5,25.43 HX711-EXTERN.B4 35.99,25.26 49.2,25.26 50.52,26.58 50.52,30.21 | v54.81,46.39 54.65,46.56 54.65,50.69 I2C-EXTENSION.5 | 37.15,72.64 37.97,73.47 LED-VL.B4 | 37.15,72.64 36.49,71.98 36.49,67.03 36.65,66.86 36.65,61.91 36.49,61.75 v36.49,57.95 v36.49,52.34 36.65,51.84 36.65,48.21 48.21,36.65 48.21,34.34 HX711.GND 48.7,34.18 49.2,34.18 50.52,32.85 50.52,30.21
  Bottom 1.016: 37.15,72.64 33.68,76.11 27.24,76.11 25.43,74.3 25.43,73.64 LED-VR.B4 24.93,74.46 23.28,76.11 14.53,76.11 12.71,74.3 12.71,73.64 LED-VD.B4 | v51.02,30.21 50.52,30.21 | v97.9,15.52 97.08,15.52 96.42,16.18 93.94,16.18 82.72,27.41 82.55,27.9
  pour Top: 0,80.01 0,0 114.3,0 114.3,80.01
  pour Bottom: 0,80.01 0,0 114.3,0 114.3,80.01
KLIMA1_SCL
  Top 0.508: R33.1 68.68,19.32 68.68,25.43 KLIMA1.B4 68.85,25.59 70.66,27.41 70.66,37.81 68.68,39.79 68.68,40.62 I2CEXTENDER1.7
KLIMA1_SDA
  Top 0.508: R32.1 64.88,19.32 64.88,24.27 66.04,25.43 KLIMA1.B3 65.88,25.59 68.02,27.74 68.68,27.74 70,29.06 70,31.86 69.18,32.69 69.01,32.69 61.09,40.62 I2CEXTENDER1.2
KLIMA2_SCL
  Top 0.508: R31.1 81.39,19.32 81.39,25.43 KLIMA2.B4 81.56,25.59 82.88,26.91 82.88,38.3 81.39,39.79 81.39,40.62 I2CEXTENDER2.7
KLIMA2_SDA
  Top 0.508: R30.1 77.6,19.32 77.6,20.47 78.75,21.63 78.75,25.43 KLIMA2.B3 78.92,25.59 76.77,27.74 73.47,27.74 72.31,28.89 72.31,38.63 73.64,39.95 73.64,40.62 I2CEXTENDER2.2
LED1_BLUE
  Top 0.508: R2.2 88.99,63.73 90.31,63.73 92.95,66.37 97.08,66.37 97.9,67.2 97.9,70 96.58,71.32 95.92,71.32 94.11,73.14 94.11,73.47 LED-HR.B2
LED1_GREEN
  Top 0.508: R1.2 92.79,63.73 95.43,63.73 98.56,66.86 98.56,71.49 96.58,73.47 LED-HR.B1
LED1_RED
  Top 0.508: R3.2 85.19,63.73 85.19,65.22 87.5,67.53 87.5,70 88.82,71.32 89.48,71.32 91.3,73.14 91.3,73.47 LED-HR.B3
LED2_BLUE
  Top 0.508: R5.2 77.6,63.73 78.92,63.73 81.56,66.37 84.37,66.37 85.19,67.2 85.19,70 83.87,71.32 83.21,71.32 81.39,73.14 81.39,73.47 LED-ZL.B2
LED2_GREEN
  Top 0.508: R4.2 81.39,63.73 82.72,63.73 85.85,66.86 85.85,71.49 83.87,73.47 LED-ZL.B1
LED2_RED
  Top 0.508: R6.2 73.8,63.73 73.8,69.01 76.11,71.32 76.77,71.32 78.59,73.14 78.59,73.47 LED-ZL.B3
LED3_BLUE
  Top 0.508: R8.2 66.04,63.73 65.55,63.73 62.08,67.2 62.08,70 63.4,71.32 66.53,71.32 68.68,73.47 LED-ZR.B2
LED3_GREEN
  Top 0.508: R7.2 70,63.73 70,64.72 72.48,67.2 72.48,72.15 71.16,73.47 LED-ZR.B1
LED3_RED  (via drill 0.35)
  Top 0.508: v60.92,66.2 58.45,63.73 R9.2
  Bottom 0.508: v60.92,66.2 60.92,68.85 63.4,71.32 64.06,71.32 66.04,73.3 LED-ZR.B3
LED4_BLUE
  Top 0.508: R11.2 54.65,63.73 56.13,63.73 58.78,66.37 58.94,66.37 59.77,67.2 59.77,70.17 58.61,71.32 57.95,71.32 55.8,73.47 LED-HL.B2
LED4_GREEN
  Top 0.508: R10.2 62.08,63.73 62.08,66.2 60.43,67.86 60.43,71.49 58.45,73.47 LED-HL.B1
LED4_RED
  Top 0.508: R12.2 50.69,63.73 50.69,65.88 49.37,67.2 49.37,70 50.69,71.32 51.35,71.32 53.49,73.47 LED-HL.B3
LED5_BLUE
  Top 0.508: R16.2 43.26,63.73 43.59,63.73 47.05,67.2 47.05,70.17 45.9,71.32 45.24,71.32 43.09,73.47 LED-VL.B2
LED5_GREEN
  Top 0.508: R15.2 47.05,63.73 47.05,66.2 47.71,66.86 47.71,71.49 45.73,73.47 LED-VL.B1
LED5_RED
  Top 0.508: R17.2 39.29,63.73 39.29,64.55 36.65,67.2 36.65,70 37.97,71.32 38.63,71.32 40.78,73.47 LED-VL.B3
LED6_BLUE
  Top 0.508: R19.2 31.86,63.73 31.86,64.55 34.34,67.03 34.34,70.17 33.19,71.32 32.52,71.32 30.38,73.47 LED-VR.B2
LED6_GREEN
  Top 0.508: R18.2 35.5,63.73 35.5,70.99 33.02,73.47 LED-VR.B1
LED6_RED
  Top 0.508: R20.2 27.9,63.73 27.41,63.73 23.94,67.2 23.94,70 25.26,71.32 25.92,71.32 28.07,73.47 LED-VR.B3
LED7_BLUE
  Top 0.508: R22.2 20.47,63.73 20.47,65.88 21.63,67.03 21.63,70.17 20.47,71.32 19.81,71.32 17.67,73.47 LED-VD.B2
LED7_GREEN
  Top 0.508: R21.2 24.11,63.73 24.11,66.04 22.29,67.86 22.29,71.65 20.47,73.47 LED-VD.B1
LED7_RED
  Top 0.508: R23.2 16.51,63.73 14.69,63.73 11.39,67.03 11.39,70.17 12.55,71.32 13.21,71.32 15.35,73.47 LED-VD.B3
MCP2317_1_GPB0  (via drill 0.35)
  Top 0.508: v7.59,41.6 9.58,39.62 11.72,39.62 18.99,46.89 18.99,47.22 MCP23017_1.1
  Bottom 0.508: v7.59,41.6 7.59,42.27 5.28,44.58 FRISCHWASSERTANK.B7
MCP2317_1_GPB1
  Top 0.508: MCP23017_1.2 20.31,47.22 20.31,46.89 12.38,38.96 5.28,38.96 2.81,41.44 2.81,44.91 4.79,46.89 5.12,46.89 FRISCHWASSERTANK.B6
MCP2317_1_GPB2  (via drill 0.35)
  Top 0.508: v9.91,40.45 11.56,40.45 12.38,41.27 12.38,42.27 18.49,48.37 20.97,48.37 21.46,47.88 21.46,47.38 MCP23017_1.3
  Bottom 0.508: v9.91,40.45 3.8,40.45 2.81,41.44 2.81,47.55 4.79,49.53 FRISCHWASSERTANK.B5
MCP2317_1_GPB3
  Top 0.508: MCP23017_1.4 22.78,47.22 22.78,46.89 14.2,38.3 4.95,38.3 2.15,41.11 2.15,49.37 4.79,52.01 5.12,52.01 FRISCHWASSERTANK.B4
MCP2317_1_GPB4  (via drill 0.35)
  Top 0.508: v10.24,62.57 12.88,62.57 13.37,62.08 13.37,56.46 18.16,51.68 20.14,51.68 24.11,47.71 24.11,47.38 MCP23017_1.5
  Bottom 0.508: v10.24,62.57 7.43,59.77 7.43,56.63 5.28,54.48 FRISCHWASSERTANK.B3
MCP2317_1_GPB5_E  (via drill 0.35)
  Top 0.508: v27.24,46.06 26.25,46.06 25.43,46.89 25.43,47.22 MCP23017_1.6 | v49.37,28.07 50.19,28.07 v56.13,22.12 | v59.44,12.38 59.44,10.07 60.43,9.08 v82.55,9.08
  Bottom 0.508: v27.24,46.06 34.34,46.06 47.38,33.02 49.03,33.02 49.53,32.52 49.53,28.23 v49.37,28.07 | v56.13,22.12 56.13,15.68 v59.44,12.38 | v82.55,9.08 88.99,9.08 91.3,6.77 91.3,6.44 GPIO_EXTENSION.B13
MCP2317_1_GPB6_E  (via drill 0.35)
  Top 0.508: v26.75,48.7 26.75,47.38 MCP23017_1.7 | v35.5,62.24 48.04,62.24 49.37,60.92 49.37,59.77 53.33,55.8 65.88,55.8 v70.66,51.02 | v84.53,36.82 84.53,35.5 87.01,33.02 v87.01,24.6
  Bottom 0.508: v26.75,48.7 26.75,51.35 35.5,60.1 v35.5,62.24 | v70.66,51.02 71.65,51.02 72.64,50.02 74.95,50.02 75.29,50.35 75.95,50.35 79.74,46.56 84.04,46.56 84.53,46.06 v84.53,36.82 | v87.01,24.6 88.99,22.62 88.99,22.45 94.27,17.17 97.74,17.17 100.22,14.69 100.22,13.04 100.38,12.88 100.38,9.91 99.22,8.75 96.09,8.75 94.11,6.77 94.11,6.44 GPIO_EXTENSION.B14
MCP2317_2_GPB3  (via drill 0.35)
  Top 0.508: v62.41,49.2 64.88,49.2 67.86,46.23 72.97,46.23 73.64,46.89 73.64,47.22 MCP23017_2.4 | v55.8,49.2 45.4,49.2 40.78,44.58 28.73,44.58 v22.29,38.14
  Bottom 0.508: v55.8,49.2 v62.41,49.2 | v22.29,38.14 8.59,38.14 7.43,36.98 7.43,26.09 5.61,24.27 5.28,24.27 FÄKALIENTANK.B6
MCP2317_2_GPB4  (via drill 0.35)
  Top 0.508: v78.09,44.08 77.76,44.08 74.95,46.89 74.95,47.22 MCP23017_2.5 | v56.96,16.68 54.98,16.68 v54.48,16.18 | v55.14,13.87 56.3,13.87 57.29,12.88 57.29,4.95 54.48,2.15 16.68,2.15 v2.81,16.02
  Bottom 0.508: v78.09,44.08 78.09,38.14 72.64,32.69 61.42,32.69 60.43,33.68 59.77,33.68 56.96,30.87 v56.96,16.68 | v54.48,16.18 54.48,14.53 v55.14,13.87 | v2.81,16.02 2.81,17.17 1.98,18 1.98,23.77 4.79,26.58 5.12,26.58 FÄKALIENTANK.B5
MCP2317_2_GPB5  (via drill 0.35)
  Top 0.508: v93.61,46.72 90.14,43.26 84.04,43.26 82.39,44.91 78.26,44.91 76.28,46.89 76.28,47.22 MCP23017_2.6 | v95.92,56.13 95.92,60.1 93.61,62.41 87.67,62.41 86.68,63.4 v86.68,64.22 | v35.33,75.95 12.22,75.95 1.49,65.22 1.49,34.18 v2.15,33.52
  Bottom 0.508: v93.61,46.72 93.61,53.82 v95.92,56.13 | v86.68,64.22 52.34,64.22 47.05,69.51 47.05,75.12 46.23,75.95 v35.33,75.95 | v2.15,33.52 2.15,31.86 4.79,29.22 5.12,29.22 FÄKALIENTANK.B4
MCP2317_2_GPB6  (via drill 0.35)
  Top 0.508: v73.14,48.54 73.3,48.37 76.77,48.37 77.43,47.71 77.43,47.38 MCP23017_2.7 | v51.51,41.6 v56.79,41.6 | v44.41,43.92 39.29,43.92 38.47,43.09 31.53,43.09 v24.43,35.99 | v2.81,18.33 2.81,29.72 4.79,31.7 5.12,31.7 FÄKALIENTANK.B3
  Bottom 0.508: v73.14,48.54 64.06,48.54 57.12,41.6 v56.79,41.6 | v51.51,41.6 48.7,41.6 47.22,43.09 45.07,43.09 44.41,43.75 v44.41,43.92 | v24.43,35.99 24.43,28.73 23.61,27.9 21.96,27.9 13.21,19.15 13.21,18.33 11.89,17 4.13,17 v2.81,18.33
N$1  (via drill 0.35)
  Top 0.508: v80.24,51.68 72.64,51.68 70,49.03 70,47.38 MCP23017_2.1 | v88,59.44 91.3,59.44 92.62,60.76 R1.1
  Bottom 0.508: v88,59.44 v80.24,51.68
N$2  (via drill 0.35)
  Top 0.508: v72.97,50.85 71.16,49.03 71.16,47.38 MCP23017_2.2 | v87.34,60.26 88.33,60.26 88.82,60.76 R2.1
  Bottom 0.508: v72.97,50.85 82.39,60.26 v87.34,60.26
N$3  (via drill 0.35)
  Top 0.508: v74.13,50.85 72.31,49.03 72.31,47.38 MCP23017_2.3 | v83.71,59.44 85.03,60.76 R3.1
  Bottom 0.508: v74.13,50.85 75.95,52.67 75.95,52.83 82.55,59.44 v83.71,59.44
N$4
  Top 0.508: MCP23017_2.21 78.75,56.96 78.75,58.28 81.23,60.76 R4.1
N$5
  Top 0.508: MCP23017_2.22 77.43,56.96 77.43,60.76 R5.1
N$6
  Top 0.508: MCP23017_2.23 76.11,56.96 76.11,58.45 73.8,60.76 R6.1
N$7
  Top 0.508: MCP23017_2.24 74.79,56.96 74.79,57.45 72.64,59.6 71.16,59.6 70,60.76 R7.1
N$8
  Top 0.508: MCP23017_2.25 73.64,56.96 73.64,57.29 71.98,58.94 70.5,58.94 69.84,59.6 67.2,59.6 66.04,60.76 R8.1
N$9
  Top 0.508: MCP23017_2.26 72.31,56.79 72.31,56.3 71.82,55.8 66.86,55.8 63.07,59.6 59.6,59.6 58.45,60.76 R9.1
N$10
  Top 0.508: MCP23017_2.27 70.99,56.96 70.99,57.45 69.51,58.94 64.72,58.94 62.9,60.76 62.24,60.76 R10.1
N$11  (via drill 0.35)
  Top 0.508: v66.86,56.96 69.84,56.96 MCP23017_2.28 | v58.45,56.96 54.65,60.76 R11.1
  Bottom 0.508: v58.45,56.96 v66.86,56.96
N$12  (via drill 0.35)
  Top 0.508: v78.75,48.7 78.75,47.38 MCP23017_2.8 | v76.77,52.5 70.33,52.5 v67.86,54.98 | v52.5,59.11 50.85,60.76 R12.1
  Bottom 0.508: v78.75,48.7 78.75,50.52 v76.77,52.5 | v67.86,54.98 56.63,54.98 v52.5,59.11
N$13  (via drill 0.35)
  Top 0.508: v41.27,59.44 35.83,53.99 28.4,53.99 27.9,54.48 27.9,56.79 MCP23017_1.21 | v45.57,59.44 46.89,60.76 R15.1
  Bottom 0.508: v45.57,59.44 v41.27,59.44
N$14
  Top 0.508: MCP23017_1.22 26.75,56.79 26.75,54.65 28.07,53.33 38.3,53.33 39.62,54.65 41.77,54.65 43.09,55.97 43.09,60.76 R16.1
N$15
  Top 0.508: MCP23017_1.23 25.43,56.96 25.43,57.29 27.08,58.94 37.48,58.94 39.29,60.76 R17.1
N$16  (via drill 0.35)
  Top 0.508: v24.93,55.64 24.27,56.3 24.27,56.79 MCP23017_1.24 | v33.85,60.76 35.5,60.76 R18.1
  Bottom 0.508: v24.93,55.64 28.73,55.64 v33.85,60.76
N$17
  Top 0.508: MCP23017_1.25 22.95,56.96 22.95,57.29 25.26,59.6 30.54,59.6 31.7,60.76 R19.1
N$18
  Top 0.508: MCP23017_1.26 21.46,56.79 21.46,56.3 20.97,55.8 18.49,55.8 18.16,56.13 18.16,61.09 19.15,62.08 26.75,62.08 27.9,60.92 R20.1
N$19
  Top 0.508: MCP23017_1.27 20.47,56.96 20.47,57.45 23.77,60.76 24.11,60.76 R21.1
N$20
  Top 0.508: MCP23017_1.28 19.15,56.96 19.15,59.6 20.31,60.76 R22.1
N$21
  Top 0.508: MCP23017_2.18 82.55,57.29 83.21,57.95 89.48,57.95 91.3,56.13 R34.2
N$22  (via drill 0.35)
  Top 0.508: v32.36,58.12 31.86,57.62 31.86,56.96 MCP23017_1.18 | v34.01,59.77 34.18,59.77 34.34,59.6 36.98,59.6 v37.64,60.26 | v40.45,57.45 40.45,56.3 40.62,56.13 R35.2
  Bottom 0.508: v34.01,59.77 v32.36,58.12 | v40.45,57.45 v37.64,60.26
N$23
  Top 0.508: HX711.E+ 22.95,36.82 22.95,36.32 25.76,33.52 25.76,9.25 22.95,6.44 GASWAAGE.B4
N$24
  Top 0.508: HX711.E- 22.95,34.18 22.95,33.68 24.77,31.86 24.77,22.78 15.68,13.7 14.69,13.7 13.87,12.88 13.87,9.91 15.02,8.75 18.33,8.75 20.31,6.77 20.31,6.44 GASWAAGE.B3
N$25  (via drill 0.35)
  Top 0.508: v15.35,14.53 24.11,23.28 24.11,30.05 22.95,31.2 22.95,31.7 HX711.A-
  Bottom 0.508: v15.35,14.53 14.53,14.53 13.21,13.21 13.21,5.61 14.69,4.13 15.85,4.13 17.67,5.94 17.67,6.27 GASWAAGE.B2
N$26
  Top 0.508: HX711.A+ 22.78,29.06 22.78,28.73 13.7,19.65 13.7,14.86 13.21,14.36 13.21,8.42 15.19,6.44 GASWAAGE.B1
N$29
  Top 0.508: R23.1 16.51,54.32 18.49,52.34 24.27,52.34 27.9,48.7 27.9,47.38 MCP23017_1.8
RP_GPIO4  (via drill 0.35)
  Top 0.508: v83.71,18 v94.6,18 | v61.91,15.85 60.26,17.5 51.18,17.5 44.58,10.9 44.58,7.76 43.26,6.44 RADAR.B3
  Bottom 0.508: v94.6,18 97.9,18 99.22,16.68 101.04,16.68 102.53,15.19 105.83,15.19 106.66,16.02 106.66,17 107.48,17.83 108.47,17.83 109.13,18.49 109.13,22.12 107.97,23.28 107.97,24.11 RASPBERRY-PI.7 | v83.71,18 76.11,18 73.97,15.85 v61.91,15.85
RP_GPIO5  (via drill 0.35)
  Top 0.508: v94.27,31.7 96.25,33.68 v96.25,34.51
  Bottom 0.508: v94.27,31.7 92.29,31.7 91.47,30.87 91.47,30.05 90.64,29.22 89.81,29.22 88.99,28.4 88.99,27.41 89.65,26.75 90.47,26.75 91.3,25.92 91.3,25.09 92.62,23.77 92.62,22.95 GEHÄUSEDECKEL.16 | v96.25,34.51 105,43.26 105.99,43.26 106.66,43.92 106.66,50.85 107.81,52.01 RASPBERRY-PI.29
RP_GPIO6  (via drill 0.35)
  Top 0.508: 103.19,50.85 102.03,52.01 100.55,52.01 R29.2 | 103.19,50.85 105.99,50.85 106.66,51.51 106.66,53.33 107.81,54.48 RASPBERRY-PI.31 | v99.22,46.39 99.22,42.93 93.28,36.98 92.46,36.98 91.47,35.99 91.47,35.17 90.64,34.34 89.81,34.34 88.33,32.85 88.33,28.07 90.14,26.25 90.14,25.43 GEHÄUSEDECKEL.13 | v103.02,50.19 103.02,50.69 103.19,50.85
  Bottom 0.508: v103.02,50.19 v99.22,46.39
RP_GPIO7_E  (via drill 0.35)
  Top 0.508: v102.86,46.89 105.33,46.89 RASPBERRY-PI.26 | v95.92,54.98 92.29,58.61 83.38,58.61 82.72,59.27 82.72,61.91 82.55,62.08 v55.97,62.08
  Bottom 0.508: v102.86,46.89 101.21,46.89 99.56,45.24 97.9,45.24 95.92,47.22 v95.92,54.98 | v55.97,62.08 54.15,62.08 40.62,48.54 40.62,46.56 51.84,35.33 53,35.33 55.31,33.02 55.31,14.86 59.6,10.57 59.6,9.91 60.76,8.75 69.01,8.75 70.99,6.77 70.99,6.44 GPIO_EXTENSION.B5
RP_GPIO8_E
  Top 0.508: RASPBERRY-PI.24 105.5,44.58 106.32,44.58 107.48,45.73 109.79,45.73 111.44,47.38 112.1,47.38 112.6,46.89 112.6,15.02 107.15,9.58 105.66,9.58 102.69,6.6 102.69,3.63 100.38,1.32 73.3,1.32 68.68,5.94 68.68,6.27 GPIO_EXTENSION.B4
RP_GPIO9_E  (via drill 0.35)
  Top 0.508: v106.82,10.4 111.94,15.52 111.94,40.78 110.95,41.77 107.97,41.77 RASPBERRY-PI.21
  Bottom 0.508: v106.82,10.4 106.49,10.4 101.04,4.95 101.04,4.62 99.89,3.47 88.99,3.47 86.51,5.94 86.51,6.27 GPIO_EXTENSION.B11
RP_GPIO10_E  (via drill 0.35)
  Top 0.508: v110.45,28.07 110.45,16.51 101.87,7.92 v101.87,4.46
  Bottom 0.508: v110.45,28.07 110.45,36.98 108.64,38.8 108.47,38.8 107.97,39.29 RASPBERRY-PI.19 | v101.87,4.46 100.22,2.81 87.17,2.81 83.71,6.27 GPIO_EXTENSION.B10
RP_GPIO12_E  (via drill 0.35)
  Top 0.508: v102.53,70.5 106.66,66.37 106.66,64.39 107.48,63.56 108.31,63.56 109.13,62.74 109.13,56.63 108.47,55.97 107.64,55.97 106.32,54.65 105.5,54.65 RASPBERRY-PI.32 | v24.93,9.58 v24.93,13.37 | v77.27,3.47 76.28,3.47 73.8,5.94 73.8,6.27 GPIO_EXTENSION.B6
  Bottom 0.508: v102.53,70.5 94.44,78.59 14.86,78.59 11.39,75.12 11.39,61.75 25.92,47.22 25.92,14.36 v24.93,13.37 | v24.93,9.58 24.93,6.6 30.21,1.32 75.12,1.32 v77.27,3.47
RP_GPIO13  (via drill 0.35)
  Top 0.508: R28.2 100.55,55.97 106.66,55.97 107.81,57.12 RASPBERRY-PI.33 | v95.43,34.01 93.28,31.86 92.46,31.86 91.14,30.54 90.31,30.54 GEHÄUSEDECKEL.9
  Bottom 0.508: v95.43,34.01 95.43,38.3 104.18,47.05 104.18,52.5 105,53.33 105.83,53.33 106.66,54.15 106.66,55.97 107.81,57.12 RASPBERRY-PI.33
RP_GPIO14_E  (via drill 0.35)
  Top 0.508: v96.09,15.02 98.89,17.83 98.89,19.98 99.39,20.47 101.7,20.47 105.33,24.11 RASPBERRY-PI.8 | v58.61,14.36 58.61,14.03 57.95,13.37 57.95,4.62 61.25,1.32 62.57,1.32 66.04,4.79 GPIO_EXTENSION.B3
  Bottom 0.508: v96.09,15.02 62.9,15.02 62.24,14.36 v58.61,14.36
RP_GPIO16_E  (via drill 0.35)
  Top 0.508: v34.67,72.97 40.28,78.59 95.43,78.59 101.7,72.31 101.7,64.22 105.33,60.59 105.33,59.77 RASPBERRY-PI.36 | v22.62,55.31 20.47,53.16 v18.82,53.16 | v27.74,8.75 35.5,8.75 v36.16,8.09 | v64.22,4.13 v62.24,2.15
  Bottom 0.508: v34.67,72.97 34.67,67.36 v22.62,55.31 | v18.82,53.16 18.82,46.06 25.26,39.62 25.26,15.52 24.11,14.36 24.11,13.04 26.58,10.57 26.58,9.91 v27.74,8.75 | v36.16,8.09 36.98,8.09 37.64,8.75 43.59,8.75 46.89,5.45 46.89,4.95 49.86,1.98 62.08,1.98 v62.24,2.15 | v64.22,4.13 74.3,4.13 76.11,5.94 76.11,6.27 GPIO_EXTENSION.B7
RP_GPIO17
  Top 0.508: R25.1 97.57,37.97 96.75,37.97 92.95,34.18 91.47,34.18 90.31,33.02 GEHÄUSEDECKEL.7 89.98,32.85 89.98,32.03 88.99,31.04 88.99,30.05 89.98,29.06 90.64,29.06 91.47,28.23 91.47,27.57 92.29,26.75 96.91,26.75 D1.C 97.08,26.75 98.07,26.75 99.39,28.07 104.84,28.07 105,27.9 106.66,27.9 107.81,29.06 RASPBERRY-PI.11
RP_GPIO18  (via drill 0.35)
  Top 0.508: R24.1 100.55,30.38 104.01,30.38 105.33,29.06 RASPBERRY-PI.12 | v53.82,25.59 56.3,25.59 v60.43,21.46 | v77.43,21.46 v72.48,21.46 | v87.17,21.46 93.78,21.46 v96.25,23.94
  Bottom 0.508: KüHLSCHR..B3 33.02,6.93 36.65,10.57 36.65,12.71 47.05,23.11 51.35,23.11 v53.82,25.59 | v72.48,21.46 v60.43,21.46 | v87.17,21.46 v77.43,21.46 | v96.25,23.94 102.36,23.94 104.18,25.76 104.18,27.9 105.33,29.06 RASPBERRY-PI.12
RP_GPIO19  (via drill 0.35)
  Top 0.508: R26.2 100.55,59.6 103.68,59.6 104.84,58.45 106.66,58.45 107.81,59.6 RASPBERRY-PI.35 | v87.67,36.32 87.67,26.25 90.14,23.77 90.14,22.95 GEHÄUSEDECKEL.15 | v98.07,44.41 98.07,45.9 v98.23,46.06
  Bottom 0.508: v87.67,36.32 87.67,37.31 89.81,39.46 93.12,39.46 v98.07,44.41 | v98.23,46.06 98.23,47.71 96.75,49.2 96.75,50.19 105,58.45 106.66,58.45 107.81,59.6 RASPBERRY-PI.35
RP_GPIO20_E  (via drill 0.35)
  Top 0.508: v86.02,32.85 86.02,29.06 86.18,28.89 86.18,21.63 82.39,17.83 v63.73,17.83 | v59.6,15.19 59.6,13.7 58.61,12.71 58.61,5.94 v59.44,5.12
  Bottom 0.508: v86.02,32.85 86.51,33.35 86.51,48.87 99.72,62.08 105.33,62.08 RASPBERRY-PI.38 | v63.73,17.83 62.24,17.83 v59.6,15.19 | v59.44,5.12 60.59,3.96 61.58,3.96 63.56,1.98 74.62,1.98 78.59,5.94 78.59,6.27 GPIO_EXTENSION.B8
RP_GPIO21_E  (via drill 0.35)
  Top 0.508: v105.99,20.31 106.66,19.65 106.66,16.02 99.39,8.75 83.38,8.75 81.39,6.77 81.39,6.44 GPIO_EXTENSION.B9
  Bottom 0.508: v105.99,20.31 98.73,20.31 95.43,23.61 95.43,24.27 95.92,24.77 98.73,24.77 99.72,25.76 99.72,27.74 105,33.02 105.83,33.02 106.66,32.19 106.66,31.37 107.48,30.54 108.47,30.54 109.79,31.86 109.79,36.65 108.31,38.14 107.48,38.14 106.66,38.96 106.66,39.79 107.48,40.62 108.47,40.62 108.97,40.12 111.44,40.12 111.94,40.62 111.94,41.27 110.29,42.93 110.29,61.58 108.47,63.4 107.64,63.4 106.32,64.72 105.5,64.72 RASPBERRY-PI.40
RP_GPIO22  (via drill 0.35)
  Top 0.508: 102.69,32.69 104.84,30.54 105.99,30.54 106.66,31.2 106.66,33.02 107.81,34.18 RASPBERRY-PI.15 | 102.69,32.69 101.21,34.18 100.55,34.18 R27.2 | v102.53,32.52 102.69,32.69
  Bottom 0.508: v102.53,32.52 99.22,29.22 92.29,29.22 91.14,28.07 90.31,28.07 GEHÄUSEDECKEL.11
RP_GPIO23  (via drill 0.35)
  Top 0.508: v90.64,36.82 88.33,36.82 84.7,40.45 83.38,40.45 81.89,41.94 58.45,41.94 HX711.DT
  Bottom 0.508: HX711-EXTERN.B3 33.02,25.76 35,27.74 35.66,27.74 39.62,31.7 48.21,31.7 HX711.DT | v90.64,36.82 91.3,36.16 91.3,35.33 92.29,34.34 93.12,34.34 96.25,31.2 98.23,31.2 101.21,34.18 105.33,34.18 RASPBERRY-PI.16
RP_GPIO24  (via drill 0.35)
  Top 0.508: 41.77,30.38 38.3,30.38 35.66,27.74 32.52,27.74 30.38,25.59 HX711-EXTERN.B2 | 41.77,30.38 45.07,30.38 46.23,29.22 48.21,29.22 HX711.SCK | v93.12,56.63 93.12,54.15 96.75,50.52 101.04,50.52 102.03,49.53 102.03,43.59 105,40.62 105.83,40.62 106.66,39.79 106.66,38.8 105.5,37.64 105.5,36.98 RASPBERRY-PI.18 | v61.75,47.38 54.48,47.38 41.77,34.67 41.77,30.38
  Bottom 0.508: v93.12,56.63 92.13,56.63 87.67,61.09 81.23,61.09 71.98,51.84 66.2,51.84 v61.75,47.38
RP_GPIO25  (via drill 0.35)
  Top 0.508: v111.77,46.56 108.47,43.26 107.48,43.26 106.16,41.94 105.5,41.94 RASPBERRY-PI.22 | v39.79,59.44 35.17,54.81 v28.73,54.81 | v12.55,61.75 9.41,61.75 7.43,59.77 7.43,43.92 5.28,41.77 FRISCHWASSERTANK.B8
  Bottom 0.508: v111.77,46.56 111.77,51.68 112.6,52.5 112.6,64.22 109.79,67.03 97.74,67.03 94.11,63.4 43.75,63.4 v39.79,59.44 | v28.73,54.81 23.28,54.81 22.95,54.48 19.81,54.48 v12.55,61.75
RP_GPIO26
  Bottom 0.508: GEHÄUSEDECKEL.2 92.79,40.78 92.79,54.15 99.56,60.92 106.66,60.92 107.81,62.08 RASPBERRY-PI.37
RP_GPIO27  (via drill 0.35)
  Top 0.508: v94.11,27.74 94.11,30.38 v96.42,32.69
  Bottom 0.508: v94.11,27.74 92.79,26.42 92.79,25.43 GEHÄUSEDECKEL.14 | v96.42,32.69 96.42,33.02 101.7,38.3 104.67,38.3 104.84,38.14 105.83,38.14 106.66,37.31 106.66,36.32 107.48,35.5 108.47,35.5 109.13,34.84 109.13,33.02 107.97,31.86 RASPBERRY-PI.13
RP_GPIO_11_E  (via drill 0.35)
  Top 0.508: v110.62,40.95 110.62,29.06 111.28,28.4 111.28,15.85 106.66,11.23 v106.32,11.23
  Bottom 0.508: v110.62,40.95 107.97,43.59 107.97,44.41 RASPBERRY-PI.23 | v106.32,11.23 100.38,5.28 100.38,4.95 99.56,4.13 90.81,4.13 88.99,5.94 88.99,6.27 GPIO_EXTENSION.B12
SCL  (via drill 0.35)
  Top 0.508: v83.71,45.73 83.71,47.22 MCP23017_2.12 | R14.1 100.55,22.95 101.04,23.44 101.04,26.58 D1.A 101.21,26.75 103.19,26.75 104.51,25.43 105.83,25.43 106.66,24.6 106.66,23.61 107.81,22.45 107.81,21.63 RASPBERRY-PI.5 | MCP23017_1.12 33.02,47.71 34.34,49.03 v39.13,49.03 | v43.09,53 48.21,53 49.2,52.01 58.45,52.01 59.6,50.85 I2C-EXTENSION.9 59.77,50.69 62.08,48.37 64.72,48.37 67.53,45.57 68.19,45.57 v69.84,43.92
  Bottom 0.508: 83.71,44.91 83.71,40.45 81.39,38.14 I2CEXTENDER2.6 | 83.71,44.91 v83.71,45.73 | 72.48,41.27 73.14,41.94 74.79,41.94 77.76,44.91 83.71,44.91 | 72.48,41.27 69.34,38.14 68.68,38.14 I2CEXTENDER1.6 | v43.09,53 v39.13,49.03 39.29,48.87 39.29,46.89 54.65,31.53 54.65,18.33 50.35,14.03 48.04,14.03 46.89,12.88 46.89,9.91 47.71,9.08 53.49,9.08 55.8,6.77 55.8,6.44 ADX345.B4 | RASPBERRY-PI.5 107.81,21.63 107.81,22.45 106.66,23.61 106.66,27.08 107.48,27.9 109.46,27.9 110.12,27.24 110.78,27.24 112.6,29.06 112.6,44.58 110.95,46.23 110.95,62.57 111.11,62.74 111.11,63.4 108.47,66.04 97.74,66.04 93.45,61.75 78.09,61.75 68.85,52.5 61.42,52.5 59.77,50.85 I2C-EXTENSION.9 | v69.84,43.92 72.48,41.27
SDA  (via drill 0.35)
  Top 0.508: v101.87,19.15 100.55,19.15 R13.1 | v85.36,46.06 85.19,46.23 85.19,47.22 MCP23017_2.13 | v82.06,36.82 74.95,36.82 73.8,37.97 I2CEXTENDER2.3 | v85.03,33.85 v85.03,28.89 | v41.44,48.21 37.97,48.21 37.81,48.37 35,48.37 34.34,47.71 34.34,47.38 MCP23017_1.13 | v45.4,43.92 45.4,43.75 44.08,42.43 37.15,42.43 26.58,31.86 26.58,4.95 28.73,2.81 50.02,2.81 52.17,4.95 52.17,5.12 53.33,6.27 ADX345.B3 | v57.12,38.14 60.92,38.14 I2CEXTENDER1.3
  Bottom 0.508: RASPBERRY-PI.3 107.81,19.15 106.49,17.83 104.84,17.83 103.52,19.15 v101.87,19.15 101.7,19.32 94.6,19.32 91.3,22.62 91.3,23.44 90.47,24.27 89.65,24.27 v85.03,28.89 | v85.36,46.06 85.36,36.49 84.86,35.99 | 84.86,35.99 82.88,35.99 v82.06,36.82 | I2CEXTENDER1.3 62.9,36.16 62.9,35.99 63.56,35.33 66.53,35.33 68.02,36.82 72.48,36.82 73.64,37.97 I2CEXTENDER2.3 | v85.03,33.85 85.03,35.83 84.86,35.99 | 45.24,48.21 v41.44,48.21 | 45.24,48.21 49.2,52.17 58.45,52.17 59.6,53.33 I2C-EXTENSION.10 | 45.24,48.21 45.4,48.04 v45.4,43.92 45.57,43.75 51.51,43.75 v57.12,38.14